# Altium schematic sheet MCU_Supply.SchDoc: MCU Supply
size A4; Revision: 1.0; SheetNumber: 6; SheetTotal: 11; Class: B
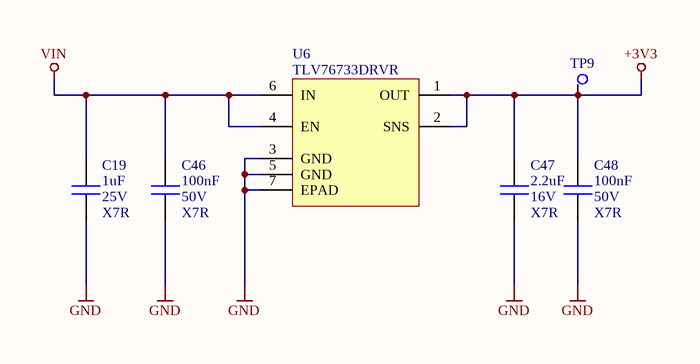
[diagram p0: MCU_Supply.SchDoc]

## Parts
C19  value 1uF  Voltage: 25V  Dielectric: X7R  [C_0603]  (hidden comment: C)
C46  value 100nF  Voltage: 50V  Dielectric: X7R  [C_0603]  (hidden comment: C)
C47  value 2.2uF  Voltage: 16V  Dielectric: X7R  [C_0805]  (hidden comment: C)
C48  value 100nF  Voltage: 50V  Dielectric: X7R  [C_0603]  (hidden comment: C)
TP9  TP_TestPoint  [TP_01]  (value not drawn)
U6  =Value: TLV76733DRVR  [WSON_6]  (hidden comment: IC_TLV76733DRVR)

## Nets
+3V3: C47.1 C48.1 TP9.1 U6.1(OUT) U6.2(SNS)
GND: C19.2 C46.2 C47.2 C48.2 U6.3(GND) U6.5(GND) U6.7(EPAD)
VIN: C19.1 C46.1 U6.4(EN) U6.6(IN)

## Notes on the sheet
- Title:
- Date:
- Revision:
- Class:
- Sheet
- of

## Library data of the parts
C19 = C_1uF_25V_0603: Capacitor; Manufacturer: Murata; Manufacturer Part Number: C0603T222K5RAC7867 / GCJ188R71E105KA01D; Tmax: 125; Tmin: -55; Grade: 2; Fail Rate: A; Tolerance: 10%; Part Number: C_1uF_25V_0603; HelpURL: https://www.murata.com/en-eu/api/pdfdownloadapi?cate=luCeramicCapacitorsSMD&partno=GCJ188R71E105KA01%23; Supplier 1: Mouser; Supplier Part Number 1: 81-GCJ188R71E105KA1D; Status: Active
C46 C48 = C_100nF_50V_0603: Capacitor; Manufacturer: Kemet; Manufacturer Part Number: C0603T104K5RCL7136; Tmax: 125; Tmin: -55; Grade: 2; Fail Rate: A; Tolerance: 10%; Part Number: C_100nF_50V_0603; HelpURL: https://content.kemet.com/datasheets/KEM_C1027_X7R_COTS_SMD.pdf; Supplier 1: Digi-Key; Supplier Part Number 1: 399-6305-1-ND; Status: Active
C47 = C_2.2uF_16V_0805: Capacitor; Manufacturer: Kemet; Manufacturer Part Number: C0805T225K4RAL7800; Tmax: 125; Tmin: -55; Grade: 2; Fail Rate: A; Tolerance: 10%; Part Number: C_2.2uF_16V_0805; HelpURL: https://content.kemet.com/datasheets/KEM_C1027_X7R_COTS_SMD.pdf; Supplier 1: Digi-Key; Supplier Part Number 1: 399-17975-6-ND; Status: Active
TP9 = TestPoint1: Manufacturer: Progresja Space; Value: TP; Grade: 3; Part Number: TestPoint1; Status: Active
U6 = TLV76733DRVR: 3.3V LDO Voltage Regulator; Manufacturer: TI; Tmax: 125; Tmin: -40; Grade: 2; Part Number: TLV76733DRVR; Value: TLV76733DRVR; HelpURL: https://www.ti.com/lit/ds/symlink/tlv767.pdf?ts=1677533353578&ref_url=https%253A%252F%252Fwww.ti.com%252Fproduct%252FTLV767%252Fpart-details%252FTLV76733DRVR; Manufacturer Part Number: TLV76733DRVR; Supplier 2: Mouser; Supplier Part Number 2: 595-TLV76733DRVR; Status: Active